# Altium schematic sheet ADCIN_ACcoupled_TCM1-83X+.SchDoc
size A3
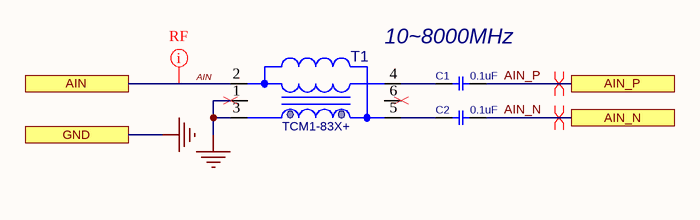
[diagram p0: ADCIN_ACcoupled_TCM1-83X+.SchDoc]

## Parts
C1  0.1uF  [C0402]
C2  0.1uF  [C0402]
T1  TCM1-83X+  [TRNS127_6_S380CW]

## Ports
AIN, AIN_N, AIN_P, GND

## Nets
GND: T1.1(NC) T1.3(PRI.) ; port GND
AIN: T1.2(PRI) ; port AIN
AIN_N: C2.2 ; port AIN_N
AIN_P: C1.2 ; port AIN_P
NetC1_1: C1.1 T1.4(SEC)
NetC2_1: C2.1 T1.5(NC)

Not connected (* = marked no-connect by the designer): T1 6(SEC.)

## Layout directives
net class RF: AIN
differential pair: AIN_N, AIN_P

## Notes on the sheet
- 10~8000MHz
- Title
- Size:
- Date:
- A3
- Number:
- Time:
- Revision:
- Sheet
- of
- File:

## Library data of the parts
C1 C2 = CAP_SMD_MLCC_100n50T: CAP, MLCC, 100nF, 50V, X7R, 10%, 0402C; MANF_P#: UMK105B7104KVHF; MANF: Taiyo Yuden; PARAM: 50V; DESC: CAP, MLCC, 100nF, 50V, X7R, 10%, 0402C; PARAM2: X7R, 10%; ASSEMBLY: ASSEMBLY; PRICE: 100= 5$; VALUE: 0.1uF
T1 = TCM1-83X+: RF Transformer, 1:1, 50Ohm, 10~8000MHz; MANF: Mini-Circuit; DESC: DESCRIPTION; PARAM2: 0.2W, 30mA, -40~85oC; ASSEMBLY: ASSEMBLY; PARAM: 10~8000MHz; PRICE: PRICE; MANF_P#: TCM1-83X+; VALUE: TCM1-83X+